# Altium schematic sheet PWR.SchDoc
size A4; SheetNumber: 2; SheetTotal: 2; SPICEModelCacheKGCQRGMS: <root> / <DocumentId>KGCQRGMS</DocumentId> / <CacheFrame Number="0"> / <Model Name="865080340001_10uf" Kind="CKT"> / <Text>******* / .subckt 865080340001_10uF 1 2 / Rser 1 3 1.3 / Lser 2 4 6.62786597E-10 / C1 3 4 0.00001 / Rpar 3 4 5333333.33333333 / .ends 865080340001_10uF</Text> / </Model> / </CacheFrame> / </root>
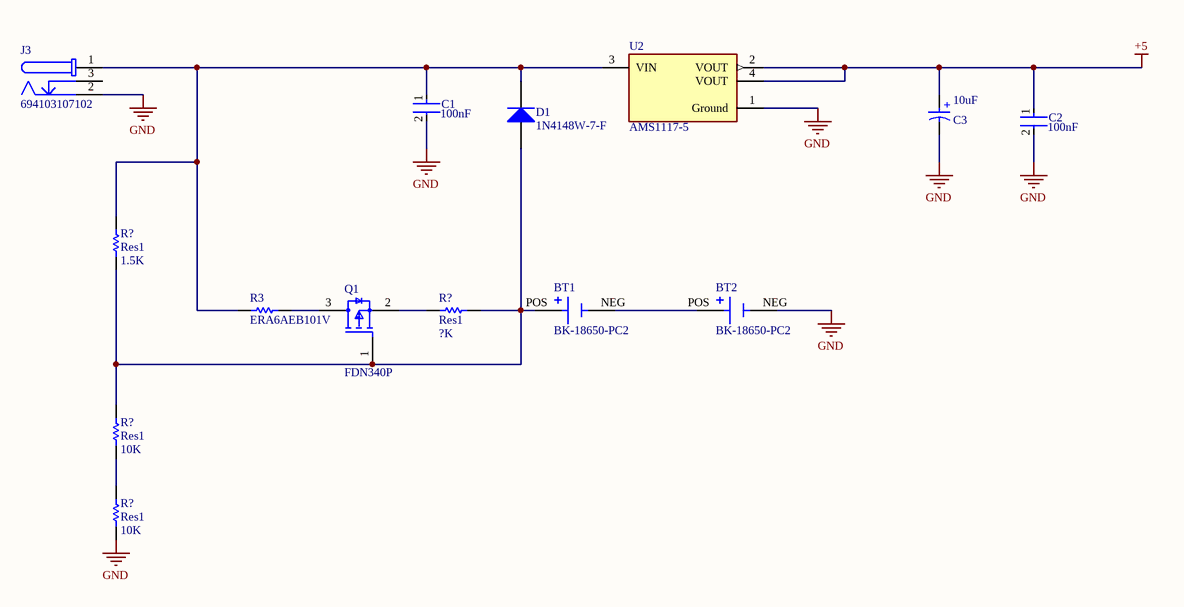
[diagram p0: PWR.SchDoc]

## Parts
(Parts that share a designator on the sheet are numbered #1, #2 ... from top to bottom, then left to right.)
BT1  BK-18650-PC2  [BAT_BK-18650-PC2]
BT2  BK-18650-PC2  [BAT_BK-18650-PC2]
C1  Capacitance: 100nF  [FP-0805-L_2_01_0_2-W_1_25-IPC_B]  (hidden comment: 08051C104K4T2A)
C2  Capacitance: 100nF  [FP-0805-L_2_01_0_2-W_1_25-IPC_B]  (hidden comment: 08051C104K4T2A)
C3  10uF  [WCAP-ASLI_D4H5.5]
D1  1N4148W-7-F  [DIOD-SOD123-2_V]
J3  694103107102  [694103107102]
Q1  FDN340P  [FP-527AG-MFG]
R3  ERA6AEB101V  [RESC2013X60X40ML20T25]
R?#1  Res1  value 1.5K  [AXIAL-0.3]
R?#2  Res1  value ?K  [AXIAL-0.3]
R?#3  Res1  value 10K  [AXIAL-0.3]
R?#4  Res1  value 10K  [AXIAL-0.3]
U2  AMS1117-5  [FP-AMS1117-IPC_C]

## Nets
+5: C2.1 C3.1(P) U2.2(VOUT) U2.4(VOUT)
GND: BT2.NEG C1.2 C2.2 C3.2(N) J3.2 R?#4.1 U2.1(Ground)
NetBT1_NEG: BT1.NEG BT2.POS
NetBT1_POS: BT1.POS D1.1(A) Q1.1(G) R?#1.1 R?#2.2 R?#3.2
NetC1_1: C1.1 D1.2(K) J3.1 R3.1 R?#1.2 U2.3(VIN)
NetQ1_2: Q1.2(S) R?#2.1
NetQ1_3: Q1.3(D) R3.2
NetR?#3_1: R?#3.1 R?#4.2

Not connected (* = marked no-connect by the designer): J3 3

## Notes on the sheet
- (in symbol 865080340001) +

## Library data of the parts
BT1 BT2 = BK-18650-PC2: Battery Holder (Open) 18650 1 Cell PC Pin; Price: None; Value: *; Package: None; Availability: Unavailable; MP: BK-18650-PC2
C1 C2 = CMP-2007-04172-2: Automotive Ceramic Capacitor, 0805, 100nF, 10%, X7R, 15%, 100V; Voltage Rating (DC): 100V; Case Code (Metric): 2012; Mount: Surface Mount; Length: 2.01mm; Depth: 1.25mm; Lead Free: Lead Free; Ratings: AEC-Q200; Max Operating Temperature: 125°C; Tolerance: 10%; Case/Package: 0805; Width: 0.049inch; Package Quantity: 1; Thickness: 0.055inch; Construction: Flat; Min Operating Temperature: -55°C; REACH SVHC: No SVHC; Number of Pins: 2; Radiation Hardening: No; Voltage Rating: 100V; Height: 1.4mm; Series: -; Voltage: 100V; Dielectric: X7R; Termination: SMD/SMT; Case Code (Imperial): 0805; RoHS Compliant: Yes; Packaging: Tape and Reel; Dielectric Material: Ceramic
C3 = 865080340001: WCAP-ASLI Aluminum Electrolytic Capacitor, V-Chip, D4 x H5.5mm, 10uF, 16V; Manufacturer: Wurth Elektronik; Capacitance Tolerance: +/-20%; Dissipation Factor: 16%; Endurance: 2000h; Leakage Current: 3uA; Ripple Current: 80mA; Technical Reference: ASEB055100M016DVCTAB000; Manufacturer Part Number: 865080340001; Category: Aluminum Electrolytic Capacitors; Match Code: WCAP-ASLI; ComponentLink1Description: Website Link; ComponentLink1URL: https://www.we-online.com/redexpert/article/865080340001?ad; ComponentLink2Description: Datasheet Link; ComponentLink2URL: https://www.we-online.com/redexpert/spec/865080340001?ad; Mount: Surface Mount; Operating Temperature Max: 105°C; Operating Temperature Min: -55°C; Packaging: Tape and Reel; Height: 5.5mm; Diameter: 4mm; Capacitance: 10uF; Rated Voltage (DC): 16V
D1 = CMP-2000-04932-2: Fast Switching Diode, 100 V, 0.15 A, -65 to 150 degC, 2-Pin?SOD123, RoHS, Tape and Reel; Recovery Time: 4ns; Brand: DiodesIncorporated; Unit Weight: 0.000353oz; Max Surge Current: 2A; Peak Reverse Voltage: 100V; Ir - Reverse Current: 1uA; Vf - Forward Voltage: 1.25V; Configuration: Single; If - Forward Current: 0.15A; Product Category: Diodes-GeneralPurpose,Power,Switching; Operating Temperature Range: -65Cto+150C; Packaging: Reel; Manufacturer URL: http://www.diodes.com/; Maximum Operating Temperature: +150C; Height: 1.25mm; Minimum Operating Temperature: -65C; Product: SwitchingDiodes; Package URL: http://www.diodes.com/datasheets/ds18004.pdf; Type: SwitchingDiode; Package Reference: SOD123-2; Width: 1.7mm; Datasheet URL: http://www.farnell.com/datasheets/1915529.pdf; Datasheet Version: Rev. 24-2, 10/2013; Series: 1N4148; Factory Pack Quantity: 3000; Length: 2.85mm; RoHS: True; Manufacturer: DiodesIncorporated; Mounting Style: SMD/SMT; Package / Case: SOD-123
J3 = CMP-1502-00175-2: NexarPartId: 52645181; Connector Type: Power; Voltage Rating (DC): 18V; Insulation Resistance: 100MΩ; Shielding: Unshielded; Current Rating: 5A; Gender: Male; Contact Gender: Female; Max Operating Temperature: 85°C; RoHS: Compliant; Min Operating Temperature: -40°C; Housing Material: Polyamide; Termination: SMD/SMT; REACH SVHC: Unknown; Contact Plating: Tin; Voltage Rating: 18V; Packaging: Tape and Reel; Mount: Surface Mount; Operating Supply Voltage: 18V; Color: Black; Flammability Rating: UL94 V-0
Q1 = CMP-2100-03638-2: MOSFET P-CH 20V 2A SSOT3; Fall Time: 11ns; Rise Time: 9ns; Voltage Rating (DC): -20V; Power Dissipation: 500mW; Nominal Vgs: -800mV; Current Rating: -2A; Gate to Source Voltage (Vgs): 8V; Rds On Max: 70mR; Turn-Off Delay Time: 27ns; Element Configuration: Single; Number of Elements: 1; Input Capacitance: 779pF; Drain to Source Resistance: 60mR; Turn-On Delay Time: 10ns; Package Quantity: 1; Mount: Surface Mount; Case/Package: SOT-23; Min Operating Temperature: -55°C; REACH SVHC: No SVHC; Weight: 0.03g; Packaging: Tape and Reel; Threshold Voltage: -800mV; Max Operating Temperature: 150°C; Dual Supply Voltage: -20V; Termination: SMD/SMT; Drain to Source Voltage (Vdss): 20V; Height: 0.94mm; Length: 2.92mm; Contact Plating: Tin; Width: 3.05mm; Drain to Source Breakdown Voltage: -20V; Max Power Dissipation: 500mW; Continuous Drain Current (ID): 2A; Number of Pins: 3; Lead Free: Lead Free; Radiation Hardening: No; On-State Resistance: 70MR
R3 = CMP-2001-00580-1: Manufacturer: Panasonic; Part Number: ERA6AEB101V
R?#1-R?#4 = Res1: Resistor; Published: 8-Jun-2000; LatestRevisionDate: 17-Jul-2002; LatestRevisionNote: Re-released for DXP Platform.; PackageReference: AXIAL-0.3; Publisher: Altium Limited; PackageDescription: Axial Device, Thru-Hole; 2 Leads; 0.3 in Pin Spacing
U2 = CMP-209535-000001-1: LDO Voltage Regulators 1A, 3.3V; Manufacturer Part Number: AMS1117-3.3; Manufacturer: Advanced Monolithic Systems; Dropout Voltage: 1.1V; Output Type: Fixed; Nominal Supply Current: 5mA; Max Power Dissipation: 1.2W; Max Supply Voltage: 15V; Number Of Outputs: 1; Standoff Height: 0.64mm; Max Junction Temp: +125°C; Height: 1.8mm; Package: AMS1117; Device Class L2: Power Management ICs; ComponentLink2Description: Datasheet; ComponentLink2URL: http://www.advanced-monolithic.com/pdf/ds1117.pdf; Category: IC; RoHS: TRUE; Automotive: No; Device Class L1: Integrated Circuits (ICs); Output Current: 1A; Device Class L3: Voltage Regulators - Linear; Temperature: -40°C to +125°C; Output Voltage: 3.3V; Temperature Range Low: -40°C; Octopart: https://octopart.com/ams1117-3.3-advanced+monolithic+systems-25899300; Lead Free: Yes; Ipc Land Pattern Name: SOT229P700X180-4; Temperature Range High: +125°C